# Altium project ts2068Extender.PrjPcb
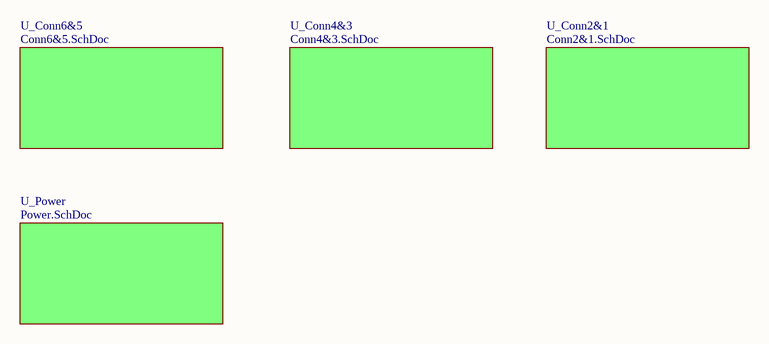
[diagram p0: extenderTop.SchDoc]
5 sheets, 18 parts. Net scope: global (net labels, ports and power ports of the same name join across sheets).
Sheets:
  extenderTop.SchDoc
    U_Power = Power.SchDoc
    U_Conn6&5 = Conn6&5.SchDoc
    U_Conn4&3 = Conn4&3.SchDoc
    U_Conn2&1 = Conn2&1.SchDoc

## Sheet extenderTop.SchDoc
size A

### Sub-sheets
U_Conn2&1 = Conn2&1.SchDoc: no entries
U_Conn4&3 = Conn4&3.SchDoc: no entries
U_Conn6&5 = Conn6&5.SchDoc: no entries
U_Power = Power.SchDoc: no entries

## Sheet Power.SchDoc
size A
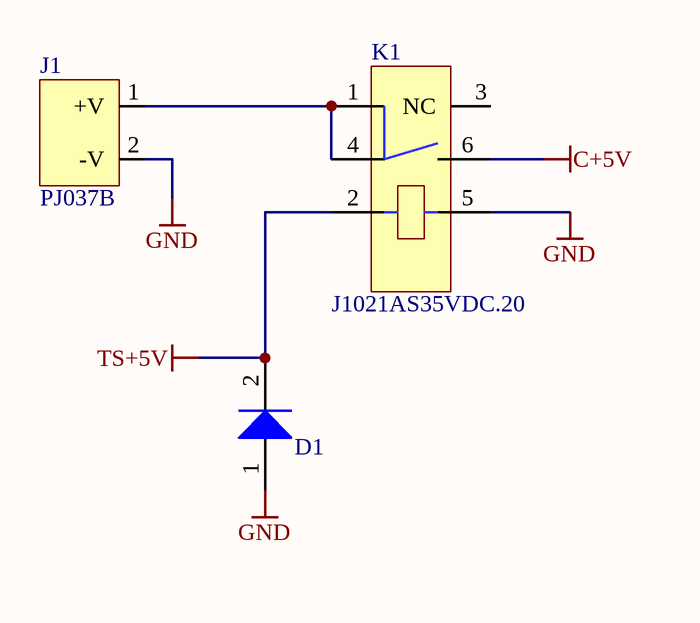
[diagram p1: Power.SchDoc]

### Parts
D1  1N4004  [DO41]  (value not drawn)
J1  PJ037B  [PJ037B]
K1  J1021AS35VDC.20  [HE7X]

### Nets
C+5V: K1.6
GND: D1.1(A) J1.2(-V) K1.5
TS+5V: D1.2(K) K1.2
NetJ1_1: J1.1(+V) K1.1 K1.4

Not connected (* = marked no-connect by the designer): K1 3(NC)

### Library data of the parts
D1 = 1N4004: Diode 400 V 1A Through Hole DO-41; MFG PN: 1N4004-T; DK PN: N4004DICT-ND; MFG: Diodes Inc; FOOTPRINT: DO-41; Populate: *
J1 = PJ037B: Power Barrel Connector Jack 2.50mm ID (0.098"), 5.50mm OD (0.217") Through Hole, Right Angle; MFG PN: PJ-037B; DK PN: CP-037B-ND; MFG: CUI
K1 = J1021AS35VDC.20: RELAY GEN PURPOSE SPST 3A 5V; DK PN: 2449-J1021AS35VDC.20-ND; MFG: CIT; MFG PN: J1021AS35VDC.20; Populate: *

## Sheet Conn6&5.SchDoc
size A
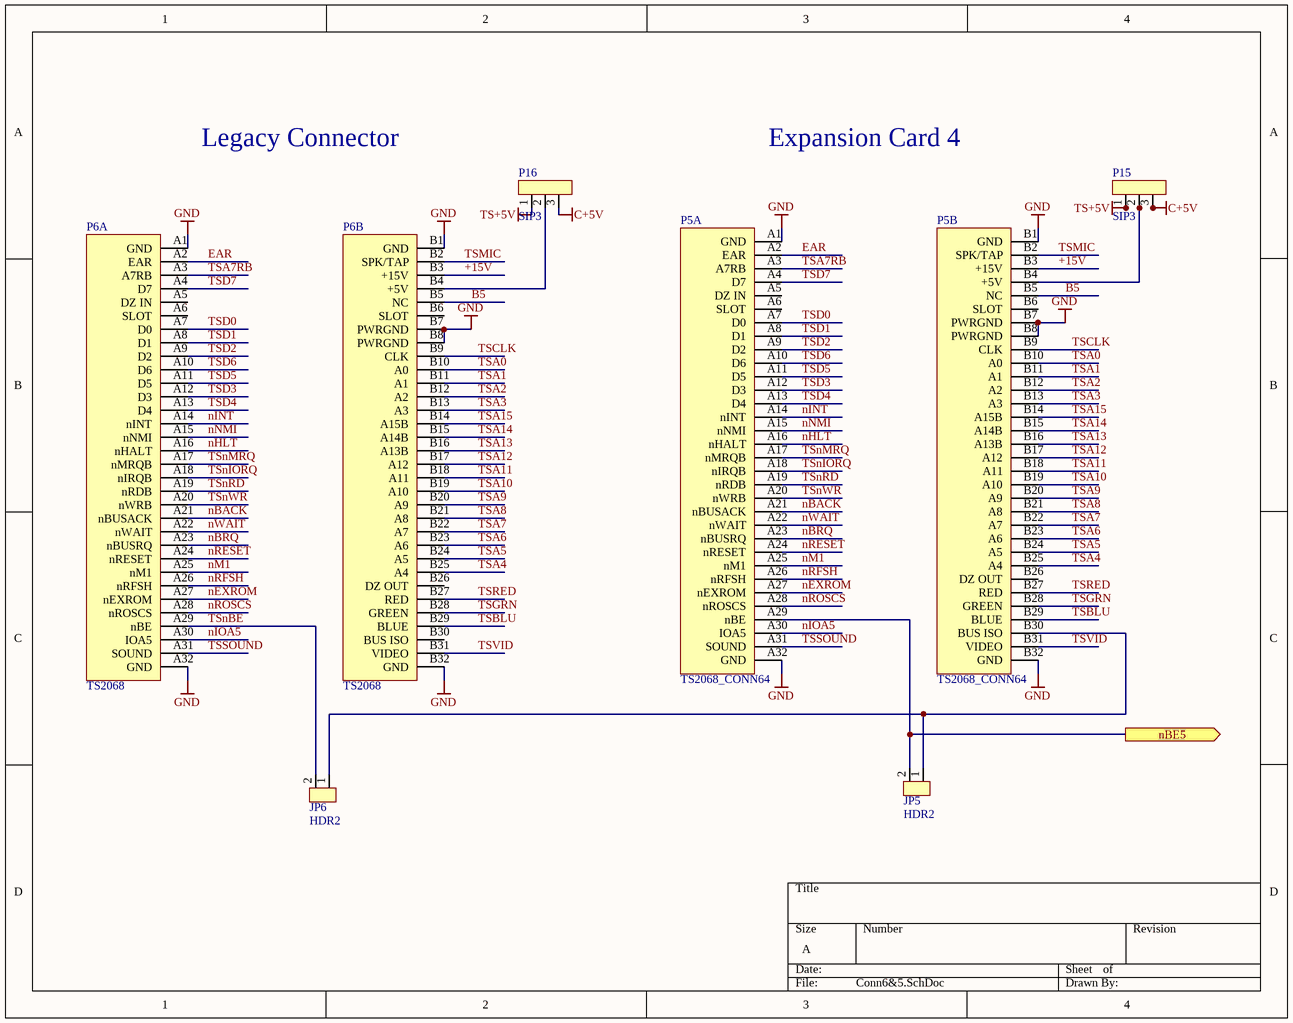
[diagram p2: Conn6&5.SchDoc]

### Parts
JP5  HDR2  [HDR2]
JP6  HDR2  [HDR2]
P5  TS2068_CONN64  [64CARDEDGE]  (parts A,B of 2)
P6  TS2068  [TS2068]  (parts A,B of 2)
P15  SIP3  [SIP3]
P16  SIP3  [SIP3]

### Ports
nBE5 (out)

### Nets
C+5V: P15.3 P16.3
GND: P5.A1(GND) P5.A32(GND) P5.B1(GND) P5.B7(PWRGND) P5.B8(PWRGND) P5.B32(GND) P6.A1(GND) P6.A32(GND) P6.B1(GND) P6.B7(PWRGND) P6.B8(PWRGND) P6.B32(GND)
TS+5V: P15.1 P16.1
+15V: P5.B3(+15V) P6.B3(+15V)
B5: P5.B5(NC) P6.B5(NC)
EAR: P5.A2(EAR) P6.A2(EAR)
nBACK: P5.A21(nBUSACK) P6.A21(nBUSACK)
nBE5: JP5.2 P5.A29(nBE) ; port nBE5
nBRQ: P5.A23(nBUSRQ) P6.A23(nBUSRQ)
nEXROM: P5.A27(nEXROM) P6.A27(nEXROM)
nHLT: P5.A16(nHALT) P6.A16(nHALT)
nINT: P5.A14(nINT) P6.A14(nINT)
nIOA5: P5.A30(IOA5) P6.A30(IOA5)
nM1: P5.A25(nM1) P6.A25(nM1)
nNMI: P5.A15(nNMI) P6.A15(nNMI)
nRESET: P5.A24(nRESET) P6.A24(nRESET)
nRFSH: P5.A26(nRFSH) P6.A26(nRFSH)
nROSCS: P5.A28(nROSCS) P6.A28(nROSCS)
nWAIT: P5.A22(nWAIT) P6.A22(nWAIT)
TSA0: P5.B10(A0) P6.B10(A0)
TSA1: P5.B11(A1) P6.B11(A1)
TSA2: P5.B12(A2) P6.B12(A2)
TSA3: P5.B13(A3) P6.B13(A3)
TSA4: P5.B25(A4) P6.B25(A4)
TSA5: P5.B24(A5) P6.B24(A5)
TSA6: P5.B23(A6) P6.B23(A6)
TSA7: P5.B22(A7) P6.B22(A7)
TSA7RB: P5.A3(A7RB) P6.A3(A7RB)
TSA8: P5.B21(A8) P6.B21(A8)
TSA9: P5.B20(A9) P6.B20(A9)
TSA10: P5.B19(A10) P6.B19(A10)
TSA11: P5.B18(A11) P6.B18(A11)
TSA12: P5.B17(A12) P6.B17(A12)
TSA13: P5.B16(A13B) P6.B16(A13B)
TSA14: P5.B15(A14B) P6.B15(A14B)
TSA15: P5.B14(A15B) P6.B14(A15B)
TSBLU: P5.B29(BLUE) P6.B29(BLUE)
TSCLK: P5.B9(CLK) P6.B9(CLK)
TSD0: P5.A7(D0) P6.A7(D0)
TSD1: P5.A8(D1) P6.A8(D1)
TSD2: P5.A9(D2) P6.A9(D2)
TSD3: P5.A12(D3) P6.A12(D3)
TSD4: P5.A13(D4) P6.A13(D4)
TSD5: P5.A11(D5) P6.A11(D5)
TSD6: P5.A10(D6) P6.A10(D6)
TSD7: P5.A4(D7) P6.A4(D7)
TSGRN: P5.B28(GREEN) P6.B28(GREEN)
TSMIC: P5.B2(SPK/TAP) P6.B2(SPK/TAP)
TSnBE: JP6.2 P6.A29(nBE)
TSnIORQ: P5.A18(nIRQB) P6.A18(nIRQB)
TSnMRQ: P5.A17(nMRQB) P6.A17(nMRQB)
TSnRD: P5.A19(nRDB) P6.A19(nRDB)
TSnWR: P5.A20(nWRB) P6.A20(nWRB)
TSRED: P5.B27(RED) P6.B27(RED)
TSSOUND: P5.A31(SOUND) P6.A31(SOUND)
TSVID: P5.B31(VIDEO) P6.B31(VIDEO)
NetJP5_1: JP5.1 JP6.1 P5.B30(BUS_ISO)
NetP5_B4: P5.B4(+5V) P15.2
NetP6_B4: P6.B4(+5V) P16.2

Not connected (* = marked no-connect by the designer): P5 A5(DZ_IN) A6(SLOT) B6(SLOT) B26(DZ_OUT); P6 A5(DZ_IN) A6(SLOT) B6(SLOT) B26(DZ_OUT) B30(BUS_ISO)

### Notes on the sheet
- Legacy Connector
- Expansion Card 4

### Library data of the parts
P5 = TS2068_CONN64: 64 Position Female Connector Non Specified - Dual Edge Gold 0.100" (2.54mm) Black; MFG: TD; MFG PN: 1761469-1; DK PN: 1761469-1-ND; FOOTPRINT: ESW-40; Populate: *
P6 = TS2068: Populate: *

## Sheet Conn4&3.SchDoc
size A
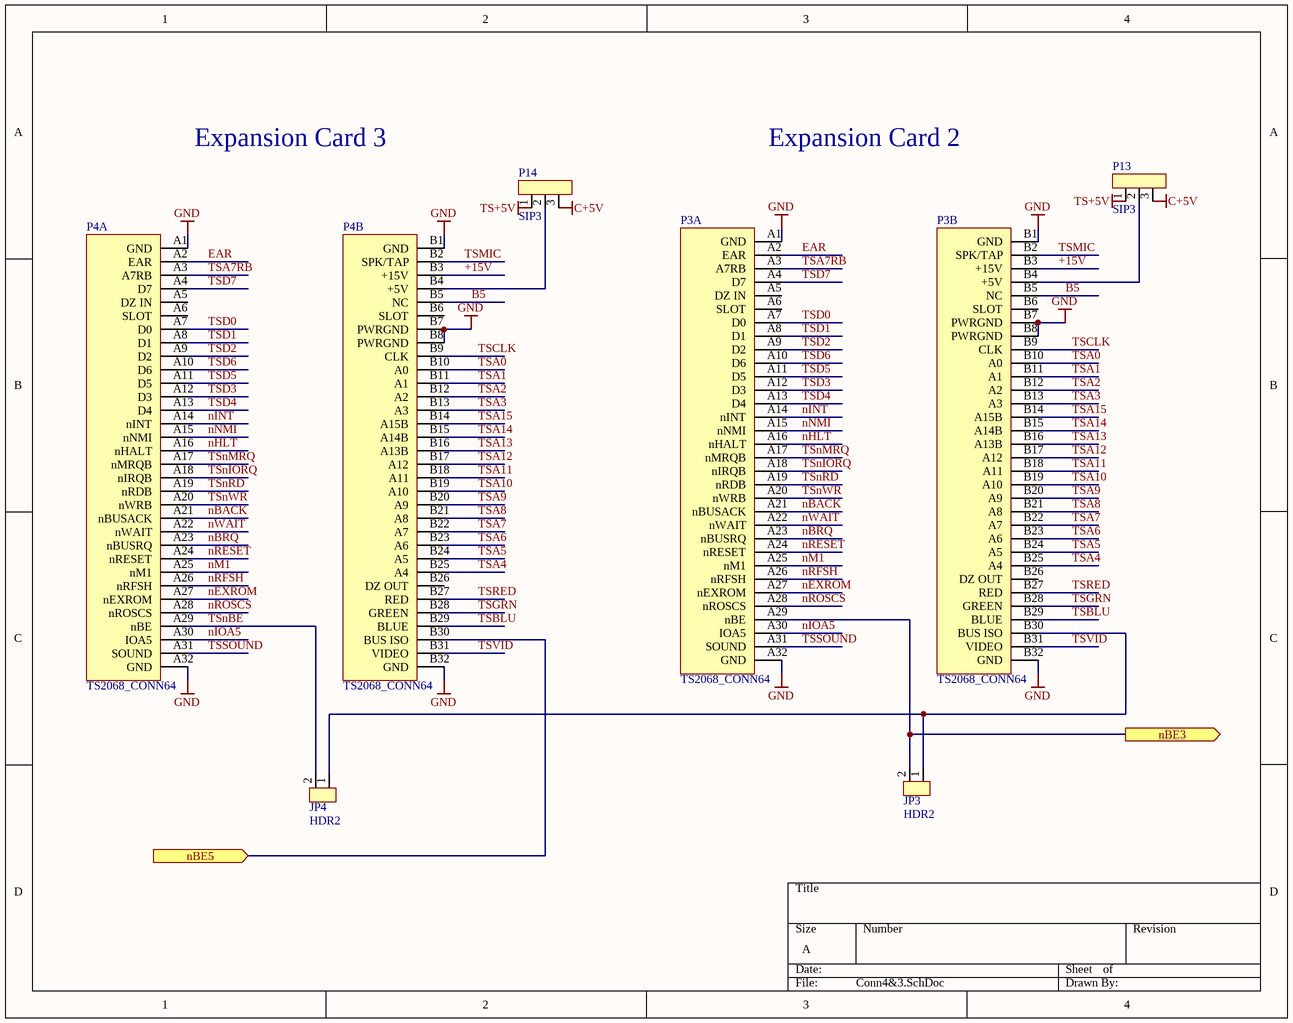
[diagram p3: Conn4&3.SchDoc]

### Parts
JP3  HDR2  [HDR2]
JP4  HDR2  [HDR2]
P3  TS2068_CONN64  [64CARDEDGE]  (parts A,B of 2)
P4  TS2068_CONN64  [64CARDEDGE]  (parts A,B of 2)
P13  SIP3  [SIP3]
P14  SIP3  [SIP3]

### Ports
nBE3 (out), nBE5 (in)

### Nets
C+5V: P13.3 P14.3
GND: P3.A1(GND) P3.A32(GND) P3.B1(GND) P3.B7(PWRGND) P3.B8(PWRGND) P3.B32(GND) P4.A1(GND) P4.A32(GND) P4.B1(GND) P4.B7(PWRGND) P4.B8(PWRGND) P4.B32(GND)
TS+5V: P13.1 P14.1
+15V: P3.B3(+15V) P4.B3(+15V)
B5: P3.B5(NC) P4.B5(NC)
EAR: P3.A2(EAR) P4.A2(EAR)
nBACK: P3.A21(nBUSACK) P4.A21(nBUSACK)
nBE3: JP3.2 P3.A29(nBE) ; port nBE3
nBE5: P4.B30(BUS_ISO) ; port nBE5
nBRQ: P3.A23(nBUSRQ) P4.A23(nBUSRQ)
nEXROM: P3.A27(nEXROM) P4.A27(nEXROM)
nHLT: P3.A16(nHALT) P4.A16(nHALT)
nINT: P3.A14(nINT) P4.A14(nINT)
nIOA5: P3.A30(IOA5) P4.A30(IOA5)
nM1: P3.A25(nM1) P4.A25(nM1)
nNMI: P3.A15(nNMI) P4.A15(nNMI)
nRESET: P3.A24(nRESET) P4.A24(nRESET)
nRFSH: P3.A26(nRFSH) P4.A26(nRFSH)
nROSCS: P3.A28(nROSCS) P4.A28(nROSCS)
nWAIT: P3.A22(nWAIT) P4.A22(nWAIT)
TSA0: P3.B10(A0) P4.B10(A0)
TSA1: P3.B11(A1) P4.B11(A1)
TSA2: P3.B12(A2) P4.B12(A2)
TSA3: P3.B13(A3) P4.B13(A3)
TSA4: P3.B25(A4) P4.B25(A4)
TSA5: P3.B24(A5) P4.B24(A5)
TSA6: P3.B23(A6) P4.B23(A6)
TSA7: P3.B22(A7) P4.B22(A7)
TSA7RB: P3.A3(A7RB) P4.A3(A7RB)
TSA8: P3.B21(A8) P4.B21(A8)
TSA9: P3.B20(A9) P4.B20(A9)
TSA10: P3.B19(A10) P4.B19(A10)
TSA11: P3.B18(A11) P4.B18(A11)
TSA12: P3.B17(A12) P4.B17(A12)
TSA13: P3.B16(A13B) P4.B16(A13B)
TSA14: P3.B15(A14B) P4.B15(A14B)
TSA15: P3.B14(A15B) P4.B14(A15B)
TSBLU: P3.B29(BLUE) P4.B29(BLUE)
TSCLK: P3.B9(CLK) P4.B9(CLK)
TSD0: P3.A7(D0) P4.A7(D0)
TSD1: P3.A8(D1) P4.A8(D1)
TSD2: P3.A9(D2) P4.A9(D2)
TSD3: P3.A12(D3) P4.A12(D3)
TSD4: P3.A13(D4) P4.A13(D4)
TSD5: P3.A11(D5) P4.A11(D5)
TSD6: P3.A10(D6) P4.A10(D6)
TSD7: P3.A4(D7) P4.A4(D7)
TSGRN: P3.B28(GREEN) P4.B28(GREEN)
TSMIC: P3.B2(SPK/TAP) P4.B2(SPK/TAP)
TSnBE: JP4.2 P4.A29(nBE)
TSnIORQ: P3.A18(nIRQB) P4.A18(nIRQB)
TSnMRQ: P3.A17(nMRQB) P4.A17(nMRQB)
TSnRD: P3.A19(nRDB) P4.A19(nRDB)
TSnWR: P3.A20(nWRB) P4.A20(nWRB)
TSRED: P3.B27(RED) P4.B27(RED)
TSSOUND: P3.A31(SOUND) P4.A31(SOUND)
TSVID: P3.B31(VIDEO) P4.B31(VIDEO)
NetJP3_1: JP3.1 JP4.1 P3.B30(BUS_ISO)
NetP3_B4: P3.B4(+5V) P13.2
NetP4_B4: P4.B4(+5V) P14.2

Not connected (* = marked no-connect by the designer): P3 A5(DZ_IN) A6(SLOT) B6(SLOT) B26(DZ_OUT); P4 A5(DZ_IN) A6(SLOT) B6(SLOT) B26(DZ_OUT)

### Notes on the sheet
- Expansion Card 3
- Expansion Card 2

### Library data of the parts
P3 P4 = TS2068_CONN64: as P5 on sheet Conn6&5; FOOTPRINT: ESW-40; Populate: *

## Sheet Conn2&1.SchDoc
size A
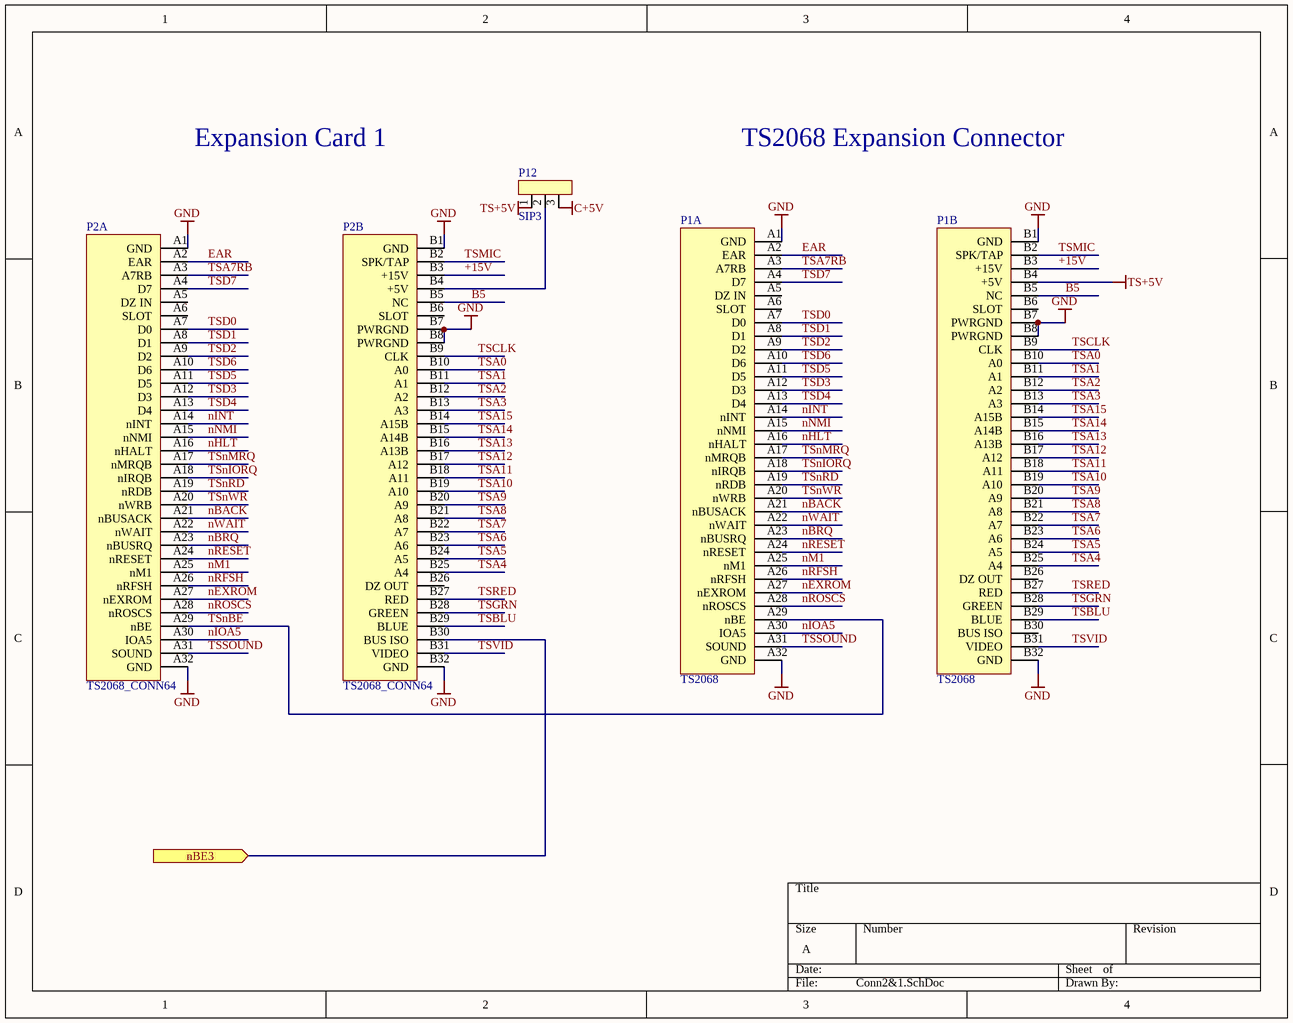
[diagram p4: Conn2&1.SchDoc]

### Parts
P1  TS2068  [TS2068]  (parts A,B of 2)
P2  TS2068_CONN64  [64CARDEDGE]  (parts A,B of 2)
P12  SIP3  [SIP3]

### Ports
nBE3 (in)

### Nets
C+5V: P12.3
GND: P1.A1(GND) P1.A32(GND) P1.B1(GND) P1.B7(PWRGND) P1.B8(PWRGND) P1.B32(GND) P2.A1(GND) P2.A32(GND) P2.B1(GND) P2.B7(PWRGND) P2.B8(PWRGND) P2.B32(GND)
TS+5V: P1.B4(+5V) P12.1
+15V: P1.B3(+15V) P2.B3(+15V)
B5: P1.B5(NC) P2.B5(NC)
EAR: P1.A2(EAR) P2.A2(EAR)
nBACK: P1.A21(nBUSACK) P2.A21(nBUSACK)
nBE3: P2.B30(BUS_ISO) ; port nBE3
nBRQ: P1.A23(nBUSRQ) P2.A23(nBUSRQ)
nEXROM: P1.A27(nEXROM) P2.A27(nEXROM)
nHLT: P1.A16(nHALT) P2.A16(nHALT)
nINT: P1.A14(nINT) P2.A14(nINT)
nIOA5: P1.A30(IOA5) P2.A30(IOA5)
nM1: P1.A25(nM1) P2.A25(nM1)
nNMI: P1.A15(nNMI) P2.A15(nNMI)
nRESET: P1.A24(nRESET) P2.A24(nRESET)
nRFSH: P1.A26(nRFSH) P2.A26(nRFSH)
nROSCS: P1.A28(nROSCS) P2.A28(nROSCS)
nWAIT: P1.A22(nWAIT) P2.A22(nWAIT)
TSA0: P1.B10(A0) P2.B10(A0)
TSA1: P1.B11(A1) P2.B11(A1)
TSA2: P1.B12(A2) P2.B12(A2)
TSA3: P1.B13(A3) P2.B13(A3)
TSA4: P1.B25(A4) P2.B25(A4)
TSA5: P1.B24(A5) P2.B24(A5)
TSA6: P1.B23(A6) P2.B23(A6)
TSA7: P1.B22(A7) P2.B22(A7)
TSA7RB: P1.A3(A7RB) P2.A3(A7RB)
TSA8: P1.B21(A8) P2.B21(A8)
TSA9: P1.B20(A9) P2.B20(A9)
TSA10: P1.B19(A10) P2.B19(A10)
TSA11: P1.B18(A11) P2.B18(A11)
TSA12: P1.B17(A12) P2.B17(A12)
TSA13: P1.B16(A13B) P2.B16(A13B)
TSA14: P1.B15(A14B) P2.B15(A14B)
TSA15: P1.B14(A15B) P2.B14(A15B)
TSBLU: P1.B29(BLUE) P2.B29(BLUE)
TSCLK: P1.B9(CLK) P2.B9(CLK)
TSD0: P1.A7(D0) P2.A7(D0)
TSD1: P1.A8(D1) P2.A8(D1)
TSD2: P1.A9(D2) P2.A9(D2)
TSD3: P1.A12(D3) P2.A12(D3)
TSD4: P1.A13(D4) P2.A13(D4)
TSD5: P1.A11(D5) P2.A11(D5)
TSD6: P1.A10(D6) P2.A10(D6)
TSD7: P1.A4(D7) P2.A4(D7)
TSGRN: P1.B28(GREEN) P2.B28(GREEN)
TSMIC: P1.B2(SPK/TAP) P2.B2(SPK/TAP)
TSnBE: P1.A29(nBE) P2.A29(nBE)
TSnIORQ: P1.A18(nIRQB) P2.A18(nIRQB)
TSnMRQ: P1.A17(nMRQB) P2.A17(nMRQB)
TSnRD: P1.A19(nRDB) P2.A19(nRDB)
TSnWR: P1.A20(nWRB) P2.A20(nWRB)
TSRED: P1.B27(RED) P2.B27(RED)
TSSOUND: P1.A31(SOUND) P2.A31(SOUND)
TSVID: P1.B31(VIDEO) P2.B31(VIDEO)
NetP2_B4: P2.B4(+5V) P12.2

Not connected (* = marked no-connect by the designer): P1 A5(DZ_IN) A6(SLOT) B6(SLOT) B26(DZ_OUT) B30(BUS_ISO); P2 A5(DZ_IN) A6(SLOT) B6(SLOT) B26(DZ_OUT)

### Notes on the sheet
- Expansion Card 1
- TS2068 Expansion Connector

### Library data of the parts
P2 = TS2068_CONN64: as P5 on sheet Conn6&5; FOOTPRINT: ESW-40; Populate: *
P1 = TS2068: Populate: *

## Nets that join several sheets
C+5V: Power (K1.6), Conn6&5 (P15.3 P16.3), Conn4&3 (P13.3 P14.3), Conn2&1 (P12.3)
GND: Power (D1.1 J1.2 K1.5), Conn6&5 (12 pins), Conn4&3 (12 pins), Conn2&1 (12 pins)
TS+5V: Power (D1.2 K1.2), Conn6&5 (P15.1 P16.1), Conn4&3 (P13.1 P14.1), Conn2&1 (P1.B4 P12.1)
+15V: Conn6&5 (P5.B3 P6.B3), Conn4&3 (P3.B3 P4.B3), Conn2&1 (P1.B3 P2.B3)
B5: Conn6&5 (P5.B5 P6.B5), Conn4&3 (P3.B5 P4.B5), Conn2&1 (P1.B5 P2.B5)
EAR: Conn6&5 (P5.A2 P6.A2), Conn4&3 (P3.A2 P4.A2), Conn2&1 (P1.A2 P2.A2)
nBACK: Conn6&5 (P5.A21 P6.A21), Conn4&3 (P3.A21 P4.A21), Conn2&1 (P1.A21 P2.A21)
nBE3: Conn4&3 (JP3.2 P3.A29), Conn2&1 (P2.B30)
nBE5: Conn6&5 (JP5.2 P5.A29), Conn4&3 (P4.B30)
nBRQ: Conn6&5 (P5.A23 P6.A23), Conn4&3 (P3.A23 P4.A23), Conn2&1 (P1.A23 P2.A23)
nEXROM: Conn6&5 (P5.A27 P6.A27), Conn4&3 (P3.A27 P4.A27), Conn2&1 (P1.A27 P2.A27)
nHLT: Conn6&5 (P5.A16 P6.A16), Conn4&3 (P3.A16 P4.A16), Conn2&1 (P1.A16 P2.A16)
nINT: Conn6&5 (P5.A14 P6.A14), Conn4&3 (P3.A14 P4.A14), Conn2&1 (P1.A14 P2.A14)
nIOA5: Conn6&5 (P5.A30 P6.A30), Conn4&3 (P3.A30 P4.A30), Conn2&1 (P1.A30 P2.A30)
nM1: Conn6&5 (P5.A25 P6.A25), Conn4&3 (P3.A25 P4.A25), Conn2&1 (P1.A25 P2.A25)
nNMI: Conn6&5 (P5.A15 P6.A15), Conn4&3 (P3.A15 P4.A15), Conn2&1 (P1.A15 P2.A15)
nRESET: Conn6&5 (P5.A24 P6.A24), Conn4&3 (P3.A24 P4.A24), Conn2&1 (P1.A24 P2.A24)
nRFSH: Conn6&5 (P5.A26 P6.A26), Conn4&3 (P3.A26 P4.A26), Conn2&1 (P1.A26 P2.A26)
nROSCS: Conn6&5 (P5.A28 P6.A28), Conn4&3 (P3.A28 P4.A28), Conn2&1 (P1.A28 P2.A28)
nWAIT: Conn6&5 (P5.A22 P6.A22), Conn4&3 (P3.A22 P4.A22), Conn2&1 (P1.A22 P2.A22)
TSA0: Conn6&5 (P5.B10 P6.B10), Conn4&3 (P3.B10 P4.B10), Conn2&1 (P1.B10 P2.B10)
TSA1: Conn6&5 (P5.B11 P6.B11), Conn4&3 (P3.B11 P4.B11), Conn2&1 (P1.B11 P2.B11)
TSA2: Conn6&5 (P5.B12 P6.B12), Conn4&3 (P3.B12 P4.B12), Conn2&1 (P1.B12 P2.B12)
TSA3: Conn6&5 (P5.B13 P6.B13), Conn4&3 (P3.B13 P4.B13), Conn2&1 (P1.B13 P2.B13)
TSA4: Conn6&5 (P5.B25 P6.B25), Conn4&3 (P3.B25 P4.B25), Conn2&1 (P1.B25 P2.B25)
TSA5: Conn6&5 (P5.B24 P6.B24), Conn4&3 (P3.B24 P4.B24), Conn2&1 (P1.B24 P2.B24)
TSA6: Conn6&5 (P5.B23 P6.B23), Conn4&3 (P3.B23 P4.B23), Conn2&1 (P1.B23 P2.B23)
TSA7: Conn6&5 (P5.B22 P6.B22), Conn4&3 (P3.B22 P4.B22), Conn2&1 (P1.B22 P2.B22)
TSA7RB: Conn6&5 (P5.A3 P6.A3), Conn4&3 (P3.A3 P4.A3), Conn2&1 (P1.A3 P2.A3)
TSA8: Conn6&5 (P5.B21 P6.B21), Conn4&3 (P3.B21 P4.B21), Conn2&1 (P1.B21 P2.B21)
TSA9: Conn6&5 (P5.B20 P6.B20), Conn4&3 (P3.B20 P4.B20), Conn2&1 (P1.B20 P2.B20)
TSA10: Conn6&5 (P5.B19 P6.B19), Conn4&3 (P3.B19 P4.B19), Conn2&1 (P1.B19 P2.B19)
TSA11: Conn6&5 (P5.B18 P6.B18), Conn4&3 (P3.B18 P4.B18), Conn2&1 (P1.B18 P2.B18)
TSA12: Conn6&5 (P5.B17 P6.B17), Conn4&3 (P3.B17 P4.B17), Conn2&1 (P1.B17 P2.B17)
TSA13: Conn6&5 (P5.B16 P6.B16), Conn4&3 (P3.B16 P4.B16), Conn2&1 (P1.B16 P2.B16)
TSA14: Conn6&5 (P5.B15 P6.B15), Conn4&3 (P3.B15 P4.B15), Conn2&1 (P1.B15 P2.B15)
TSA15: Conn6&5 (P5.B14 P6.B14), Conn4&3 (P3.B14 P4.B14), Conn2&1 (P1.B14 P2.B14)
TSBLU: Conn6&5 (P5.B29 P6.B29), Conn4&3 (P3.B29 P4.B29), Conn2&1 (P1.B29 P2.B29)
TSCLK: Conn6&5 (P5.B9 P6.B9), Conn4&3 (P3.B9 P4.B9), Conn2&1 (P1.B9 P2.B9)
TSD0: Conn6&5 (P5.A7 P6.A7), Conn4&3 (P3.A7 P4.A7), Conn2&1 (P1.A7 P2.A7)
TSD1: Conn6&5 (P5.A8 P6.A8), Conn4&3 (P3.A8 P4.A8), Conn2&1 (P1.A8 P2.A8)
TSD2: Conn6&5 (P5.A9 P6.A9), Conn4&3 (P3.A9 P4.A9), Conn2&1 (P1.A9 P2.A9)
TSD3: Conn6&5 (P5.A12 P6.A12), Conn4&3 (P3.A12 P4.A12), Conn2&1 (P1.A12 P2.A12)
TSD4: Conn6&5 (P5.A13 P6.A13), Conn4&3 (P3.A13 P4.A13), Conn2&1 (P1.A13 P2.A13)
TSD5: Conn6&5 (P5.A11 P6.A11), Conn4&3 (P3.A11 P4.A11), Conn2&1 (P1.A11 P2.A11)
TSD6: Conn6&5 (P5.A10 P6.A10), Conn4&3 (P3.A10 P4.A10), Conn2&1 (P1.A10 P2.A10)
TSD7: Conn6&5 (P5.A4 P6.A4), Conn4&3 (P3.A4 P4.A4), Conn2&1 (P1.A4 P2.A4)
TSGRN: Conn6&5 (P5.B28 P6.B28), Conn4&3 (P3.B28 P4.B28), Conn2&1 (P1.B28 P2.B28)
TSMIC: Conn6&5 (P5.B2 P6.B2), Conn4&3 (P3.B2 P4.B2), Conn2&1 (P1.B2 P2.B2)
TSnBE: Conn6&5 (JP6.2 P6.A29), Conn4&3 (JP4.2 P4.A29), Conn2&1 (P1.A29 P2.A29)
TSnIORQ: Conn6&5 (P5.A18 P6.A18), Conn4&3 (P3.A18 P4.A18), Conn2&1 (P1.A18 P2.A18)
TSnMRQ: Conn6&5 (P5.A17 P6.A17), Conn4&3 (P3.A17 P4.A17), Conn2&1 (P1.A17 P2.A17)
TSnRD: Conn6&5 (P5.A19 P6.A19), Conn4&3 (P3.A19 P4.A19), Conn2&1 (P1.A19 P2.A19)
TSnWR: Conn6&5 (P5.A20 P6.A20), Conn4&3 (P3.A20 P4.A20), Conn2&1 (P1.A20 P2.A20)
TSRED: Conn6&5 (P5.B27 P6.B27), Conn4&3 (P3.B27 P4.B27), Conn2&1 (P1.B27 P2.B27)
TSSOUND: Conn6&5 (P5.A31 P6.A31), Conn4&3 (P3.A31 P4.A31), Conn2&1 (P1.A31 P2.A31)
TSVID: Conn6&5 (P5.B31 P6.B31), Conn4&3 (P3.B31 P4.B31), Conn2&1 (P1.B31 P2.B31)